# EAGLE schematic Bridge (EAGLE 7.1.0)
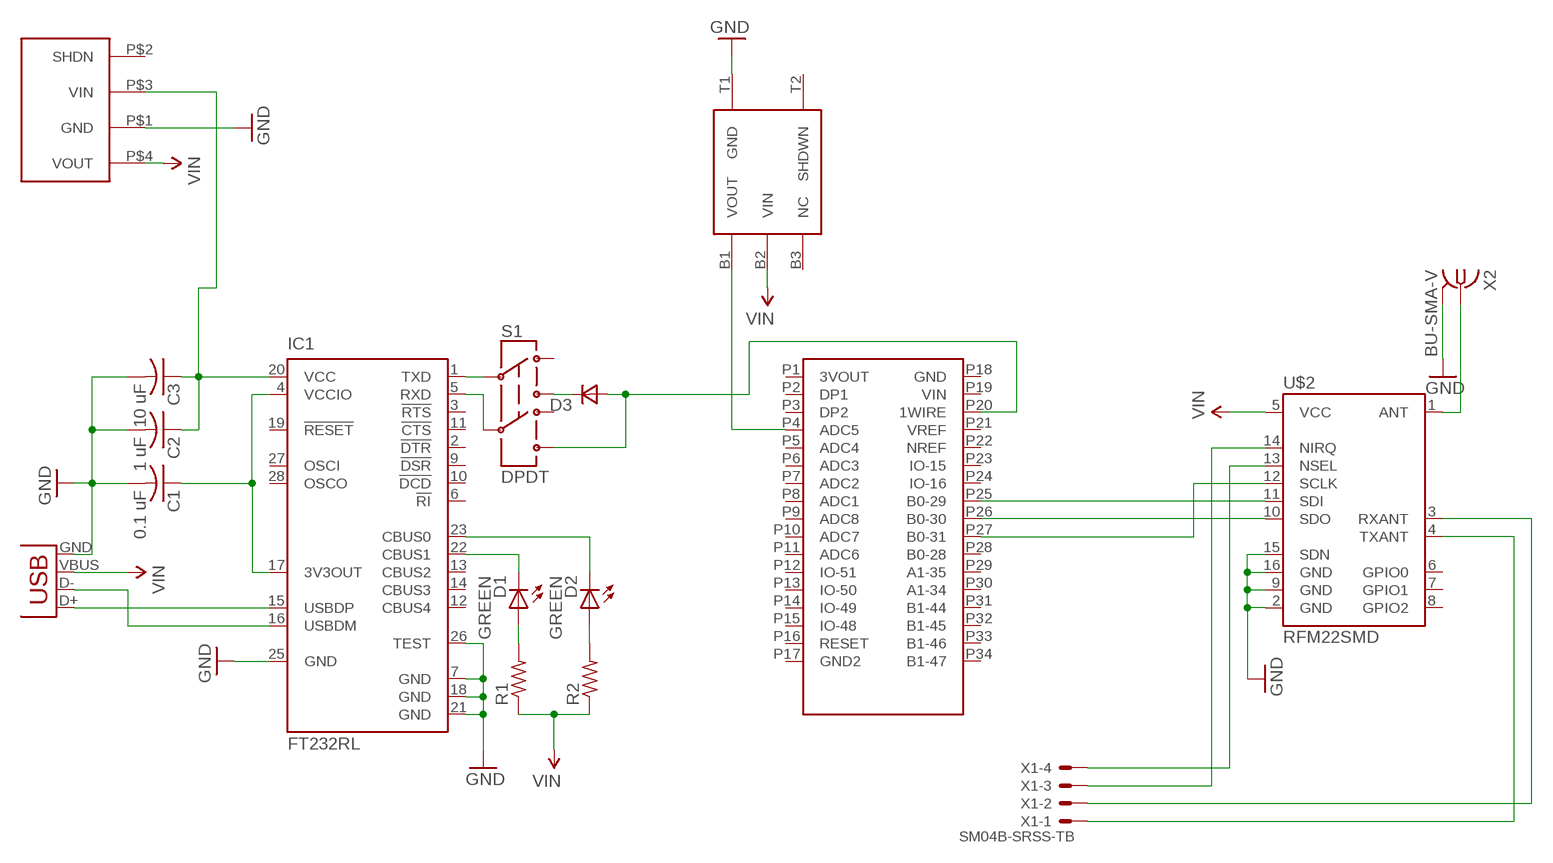
[diagram p0: schematic, sheet 1]

## Parts
C1  0.1 uF  C-USC0805  [C0805]
C2  1 uF  C-USC0805  [C0805]
C3  10 uF  C-USC0805  [C0805]
D1  GREEN  LED-GREEN0603  [LED-0603]
D2  GREEN  LED-GREEN0603  [LED-0603]
D3  DSOD323  [SOD323]
IC1  FT232RL  [SSOP28]
JP1  USBSMD  [USB-MINIB]
R1  R-US_R0603  [R0603]
R2  R-US_R0603  [R0603]
S1  DPDT  SWITCH-DPDTAYZ0202  [AYZ0202]
U$1  APP_CORE  [APPCORE_RECEIVER]
U$2  RFM22SMD  [RFM22-XXX-S2]
U$3  TMP36  [SOT-23-5]
U$6  57V8F3_EXT  [S7V8F3_EXT]
X1  SM04B-SRSS-TB  [SM04B-SRSS-TB]
X2  BU-SMA-V  [BU-SMA-V]

## Nets
GND: C1.2 C2.2 C3.2 IC1.7(GND) IC1.18(GND) IC1.21(GND) IC1.25(GND) IC1.26(TEST) JP1.GND U$2.2(GND) U$2.9(GND) U$2.15(SDN) U$2.16(GND) U$3.T1(GND) U$6.P$1(GND) X2.2 X2.3 X2.4 X2.5
N$1: IC1.16(USBDM) JP1.D-
N$2: C1.1 IC1.4(VCCIO) IC1.17(3V3OUT)
N$3: IC1.15(USBDP) JP1.D+
N$4: U$2.1(ANT) X2.1
N$5: U$2.4(TXANT) X1.1
N$6: U$2.3(RXANT) X1.2
N$7: U$2.14(NIRQ) X1.3
N$8: U$2.13(NSEL) X1.4
N$9: U$1.P4(ADC5) U$3.B1(VOUT)
N$10: U$1.P27(B0-31) U$2.12(SCLK)
N$11: U$1.P26(B0-30) U$2.10(SDO)
N$12: U$1.P25(B0-29) U$2.11(SDI)
N$13: D3.1(C) S1.3
N$14: D1.A R1.2
N$15: D2.A R2.2
N$16: D1.C IC1.22(CBUS1)
N$17: D2.C IC1.23(CBUS0)
N$18: D3.2(A) S1.6 U$1.P20(1WIRE)
N$20: IC1.1(TXD) S1.2
N$21: IC1.5(RXD) S1.5
N$23: C2.1 C3.1 IC1.20(VCC) U$6.P$3(VIN)
VIN: JP1.VBUS R1.1 R2.1 U$2.5(VCC) U$3.B2(VIN) U$6.P$4(VOUT)
Unconnected: IC1.2(!DTR) IC1.3(!RTS) IC1.6(!RI) IC1.9(!DSR) IC1.10(!DCD) IC1.11(!CTS) IC1.12(CBUS4) IC1.13(CBUS2) IC1.14(CBUS3) IC1.19(!RESET) IC1.27(OSCI) IC1.28(OSCO) S1.1 S1.4 U$1.P1(3VOUT) U$1.P2(DP1) U$1.P3(DP2) U$1.P5(ADC4) U$1.P6(ADC3) U$1.P7(ADC2) U$1.P8(ADC1) U$1.P9(ADC8) U$1.P10(ADC7) U$1.P11(ADC6) U$1.P12(IO-51) U$1.P13(IO-50) U$1.P14(IO-49) U$1.P15(IO-48) U$1.P16(RESET) U$1.P17(GND2) U$1.P18(GND) U$1.P19(VIN) U$1.P21(VREF) U$1.P22(NREF) U$1.P23(IO-15) U$1.P24(IO-16) U$1.P28(B0-28) U$1.P29(A1-35) U$1.P30(A1-34) U$1.P31(B1-44) U$1.P32(B1-45) U$1.P33(B1-46) U$1.P34(B1-47) U$2.6(GPIO0) U$2.7(GPIO1) U$2.8(GPIO2) U$3.B3(NC) U$3.T2(SHDWN) U$6.P$2(SHDN)

## Library data of the parts
C1-C3 = rcl:C-US: CAPACITOR, American symbol
D1 D2 = SparkFun-LED:LED-GREEN: Various green LEDs 0603- DIO-00821 LARGE- DIO-00862 LILYPAD- DIO-09910; PROD_ID: DIO-00821
D3 = zetex:D: DIODE; MPN: CDSOD323-T05C; OC_FARNELL: 1824860; OC_NEWARK: 79R6078
IC1 = ftdichip:FT232R: Source: http://www.ftdichip.com/Documents/DataSheets/DS_FT232R_v104.pdf; MPN: FT232RL; OC_FARNELL: 1146032; OC_NEWARK: 91K9918
JP1 = SparkFun-Connectors:USB: USB Connectors USB-B-PTH is fully proven SKU : PRT-00139/CONN-08278 USB-miniB is fully proven SKU : PRT-00587 USB-A-PCB is untested. USB-A-H is throughly reviewed, but untested. Spark Fun Electronics SKU : PRT-00437 USB-B-SMT is throughly reviewed, but untested. Needs silkscreen touching up. USB-A-S has not been used/tested USB-MB-H has not been used/tested USB-MICROB has been used. CONN-09505; PROD_ID: CONN-08193
R1 R2 = rcl:R-US_: RESISTOR, American symbol
S1 = SparkFun-Electromechanical:SWITCH-DPDT: DPDT Version of the COM-00597; PROD_ID: SWCH-08179
U$1 = LearningByMaking:APP_CORE
U$2 = SparkFun-RF:RFM22: The RFM22 is a low-power, low cost radio that is capable of operating in the 434MHz and 900MHz open bands. It's frequency is software defined and there are some very good libraries written for it.
U$3 = LearningByMaking:TMP36
U$6 = LearningByMaking:57V8F3_EXT
X1 = con-jst2:?M04B-SRSS-TB: Disconnectable Crimp style connector, 1.0mm pitch 4 contacts
X2 = con-coax:BU-SMA-V: FEMALE SMA CONNECTOR Radiall distributor RS 112-3794; OC_FARNELL: unknown; OC_NEWARK: unknown